# EAGLE design Temperature (EAGLE 7.2.0)
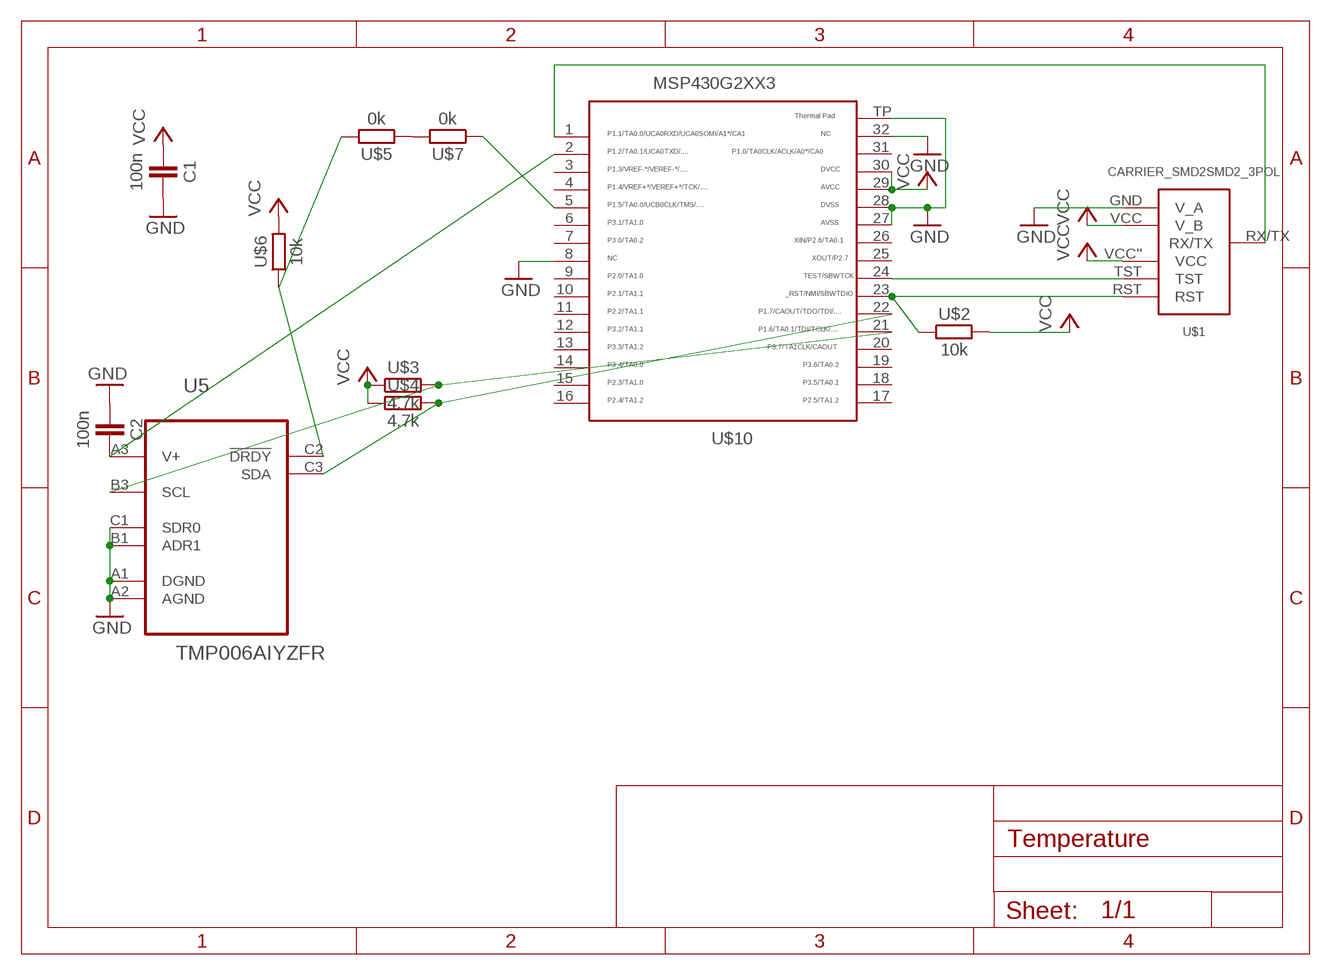
[diagram p0: schematic, sheet 1]

## Parts
C1  100n  CAPACITOR  [603]
C2  100n  CAPACITOR  [603]
U5  TMP006AIYZFR  [BGA8C50P3X3_156X156X63]
U$1  CARRIER_SMD2SMD2_3POL  [CARRIER_SMD2_3POL]
U$2  10k  RESISTOR0603  [603]
U$3  4.7k  RESISTOR0603  [603]
U$4  4.7k  RESISTOR0603  [603]
U$5  0k  RESISTOR0603  [603]
U$6  10k  RESISTOR0603  [603]
U$7  0k  RESISTOR0603  [603]
U$10  MSP430G2553  [QFN32]

## Nets
GND: C1.2 C2.1 U5.A1(DGND) U5.A2(AGND) U5.B1(ADR1) U5.C1(SDR0) U$1.GND(V_A) U$10.8 U$10.27 U$10.28 U$10.32 U$10.TP
N$2: U$7.1 U$10.5
N$3: U$1.TST U$10.24
N$4: U$1.RST U$2.1 U$10.23
N$5: U5.C3(SDA) U$4.2 U$10.22
N$6: U5.B3(SCL) U$3.2 U$10.21
N$7: C2.2 U5.A3(V+) U$10.2
N$11: U$5.1 U$7.2
N$12: U$1.RX/TX U$10.1
N$14: U5.C2(!DRDY) U$5.2 U$6.1
VCC: C1.1 U$1.VCC''(VCC) U$1.VCC(V_B) U$2.2 U$3.1 U$4.1 U$6.2 U$10.29 U$10.30
Unconnected: U$10.3 U$10.4 U$10.6 U$10.7 U$10.9 U$10.10 U$10.11 U$10.12 U$10.13 U$10.14 U$10.15 U$10.16 U$10.17 U$10.18 U$10.19 U$10.20 U$10.25 U$10.26 U$10.31

## Library data of the parts
C1 C2 = thar:CAPACITOR
U5 = TMP006:TMP006AIYZFR: Infrared Thermopile Sensor,DSBGA-8; MPN: TMP006AIYZFR; OC_FARNELL: 1909481; OC_NEWARK: 52T8758; PACKAGE: DSBGA-8; SUPPLIER: TEXAS INSTRUMENTS
U$1 = thar:CARRIER_SMD2
U$2-U$7 = thar:RESISTOR
U$10 = thar:MSP430G2553: TEXAS INSTRUMENTS MSP430G2553IRHB32R MCU, 16BIT, MSP430, 16MHZ, QFN-32 Farnell Best.Nr.: 2325726 Herst.Bez.: MSP430G2553IRHB32R

## Board
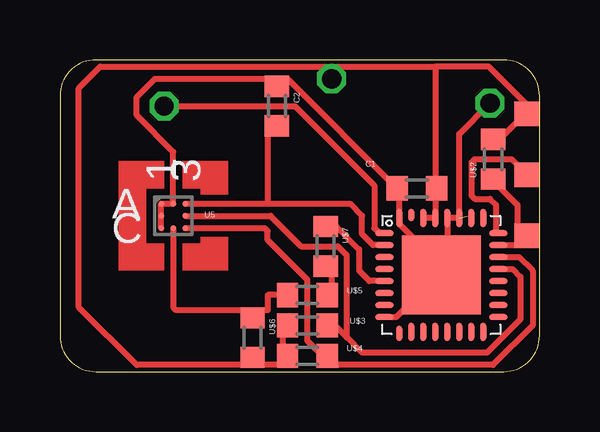
[diagram p1: board, top side]
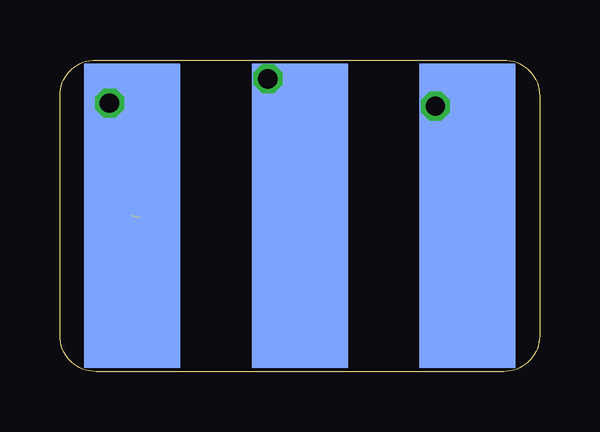
[diagram p2: board, bottom side, seen from below]

Size 20 x 13 mm. Coordinates in mm from the lower left corner, seen from the top.
Copper layers (1*16): Top 0.035mm / dielectric 1.5mm / Bottom 0.035mm
Design rules "Bilex DRU *": minimum track width 10mil, minimum drill 24mil, track to track 10mil, track to pad 10mil, pad to pad 10mil, via to via 10mil, smd to smd 10mil, copper to edge 1mil, drill to drill 8mil, minimum pad ring 10mil, minimum via ring 8mil, stop-mask expansion 4mil, vias tented up to drill 0mil, thermal gap 10mil
tRestrict: 27 lines

### Footprints (pad centres in the part's own frame; a part is rotated, then mirrored left to right if it is on the bottom)
603 = smd 0.889 x 1.016: 1 -0.826,0; 2 0.826,0
BGA8C50P3X3_156X156X63 = smd 0.254 x 0.254: A1 -0.508,0.508; A2 0,0.508; A3 0.508,0.508; B1 -0.508,0; B3 0.508,0; C1 -0.508,-0.508; C2 0,-0.508; C3 0.508,-0.508
CARRIER_SMD2_3POL = smd 4 x 12.7 bottom: GND -6.985,0; RX/TX 6.985,0; VCC 0,0 | smd 1.016 x 1.016: RST -9.461,0.826; TST -9.461,-1.714; VCC'' -9.461,-4.255
QFN32 = smd 0.762 x 0.254: 1 -2.375,1.75; 2 -2.375,1.25; 3 -2.375,0.75; 4 -2.375,0.25; 5 -2.375,-0.25; 6 -2.375,-0.75; 7 -2.375,-1.25; 8 -2.375,-1.75; 17 2.375,-1.75; 18 2.375,-1.25; 19 2.375,-0.75; 20 2.375,-0.25; 21 2.375,0.25; 22 2.375,0.75; 23 2.375,1.25; 24 2.375,1.75 | smd 0.254 x 0.635: 9 -1.75,-2.438 | smd 0.254 x 0.762: 10 -1.25,-2.375; 11 -0.75,-2.375; 12 -0.25,-2.375; 13 0.25,-2.375; 14 0.75,-2.375; 15 1.25,-2.375; 16 1.75,-2.375; 25 1.75,2.375; 26 1.25,2.375; 27 0.75,2.375; 28 0.25,2.375; 29 -0.25,2.375; 30 -0.75,2.375; 32 -1.75,2.375 | smd 0.254 x 0.508: 31 -1.25,2.5 | smd 3.302 x 3.302: TP 0,0

### Placement (x,y rotation side)
C1  14.89,7.64 180 top
C2  9.04,11.07 270 top
U5  4.73,6.5 0 top
U$1  10,6.5 180 top
U$2  18.06,8.86 90 top
U$3  10.31,1.92 0 top
U$4  10.31,0.66 0 top
U$5  10.31,3.2 180 top
U$6  8.03,1.42 270 top
U$7  11.08,5.23 270 top
U$10  15.9,4.03 0 top

### Tracks (layer width: path | path; a pad name or v marks a point on that pad's centre or on a via)
GND  (via drill 0.8)  (1 unrouted)
  Top 0.254: 16.43,4.35 16.19,5.38 16.16,5.35 | 16.43,4.35 16.48,3.06 U$10.TP 15.01,2.94 14.89,3.14 14.03,2.28 U$10.8 | 16.15,4.72 U$10.28 U$10.27 16.65,9.91 v17.93,11.2 | 16.15,4.72 16.15,4.42 16.43,4.35 | 16.15,4.72 15.52,5.35 14.76,5.55 14.15,6.16 U$10.32 14.15,7.49 14.12,7.46 14.12,7.7 C1.2 9.49,12.21 9.04,12.21 | 9.04,12.21 3.96,12.21 3.2,11.45 3.2,10.69 4.73,9.16 U5.A2 U5.A1 U5.B1 U5.C1 | C2.1 9.04,12.21
  Bottom 0.254: v17.93,11.2 17.93,6.57 18,6.5
N$2
  Top 0.254: U$7.1 11.52,6.05 12.47,5.1 12.47,4.21 12.9,3.78 U$10.5
N$3
  Top 0.254: 19.61,7.88 19.46,8.02 19.5,8.18 U$1.TST | U$10.24 18.19,5.78 18.19,6.95 17.93,7.21 17.3,7.21 17.17,7.33 17.17,8.73 17.3,8.86 18.82,8.86 19.43,8.25 U$1.TST | U$1.TST
N$4
  Top 0.254: 19.46,5.48 19.5,5.38 | 19.46,5.48 19.48,5.6 | 19.48,5.6 19.5,5.69 19.08,5.74 19.08,6.95 18.06,7.97 U$2.1 | U$10.23 19.28,5.28 19.46,5.48 | U$1.RST 19.46,5.62 19.48,5.6
N$5
  Top 0.254: U$10.22 19.14,4.78 19.71,4.21 19.71,1.92 18.06,0.27 11.59,0.27 11.27,0.59 U$4.2 10.95,0.66 10.31,1.29 10.31,3.83 8.66,5.48 8.66,5.86 8.54,5.99 U5.C3
N$6
  Top 0.254: U$10.21 18.88,4.28 19.2,3.96 19.2,2.18 17.81,0.78 12.6,0.78 11.97,1.42 | 11.97,1.42 11.52,1.86 | 11.52,1.86 11.46,1.92 U$3.2 11.52,1.86 | 11.97,1.42 11.97,4.85 11.59,5.23 10.06,5.23 8.79,6.5 U5.B3
N$7
  Top 0.254: U5.A3 8.66,7.01 | C2.2 8.66,10.18 8.66,7.01 | 8.66,7.01 12.09,7.01 12.6,6.5 12.6,5.74 13.06,5.28 U$10.2
N$11
  Top 0.254: U$7.2 11.27,4.4 11.33,4.46 11.33,3.26 U$5.1
N$12  (via drill 0.8)
  Top 0.254: U$10.1 13.32,5.78 13.11,5.99 13.11,7.77 9.81,11.07 v4.35,11.07
  Bottom 0.406: U$1.RX/TX 3.58,6.5 arc16 v4.35,11.07
N$14
  Top 0.254: U5.C2 4.73,2.69 4.85,2.56 8.16,2.56 8.22,2.5 U$6.1 8.22,2.56 8.66,2.56 8.66,3.2 U$5.2
VCC  (via drill 0.8)
  Top 0.254: U$10.29 | 15.65,12.72 15.65,8.02 | 15.65,8.02 U$10.29 | 15.78,7.77 15.71,8.02 | 15.71,8.02 15.65,8.02 | U$10.29 U$10.30 | C1.1 15.71,8.02 | 19.5,10.52 19.46,10.56 | U$2.2 18.12,9.48 19.2,10.56 19.2,10.51 19.46,10.56 | 19.52,10.62 19.65,10.75 19.65,10.95 17.88,12.72 15.65,12.72 | 19.52,10.62 19.46,10.56 | U$4.1 9.3,0.66 | 9.3,0.66 9.3,1.61 | 9.3,1.61 U$3.1 9.55,1.92 9.3,1.67 | 9.3,1.67 9.3,1.61 | 9.3,0.66 9.3,0.27 | 9.3,0.27 9.55,0.27 | 9.3,0.27 8.28,0.27 | 8.28,0.27 3.2,0.27 0.79,2.69 0.79,11.83 1.68,12.72 11.33,12.72 | v11.33,12.21 11.33,12.72 | 11.33,12.72 15.65,12.72 | 9.3,1.67 9.3,1.92 | U$1.VCC'' 19.46,10.69 19.52,10.62 | U$6.2 8.28,0.27
  Bottom 0.406: U$1.VCC 11.33,6.5 v11.33,12.21
(copper drawn outside any net)
  shapes: Top area x7